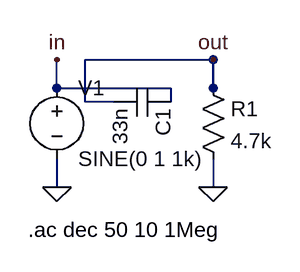
[diagram p0: schematic mystery.asc]
mystery.asc, the LTspice schematic file:
Version 4
SHEET 1 880 680
WIRE 128 80 256 80
WIRE 256 80 256 96
WIRE 192 96 160 96
WIRE 160 96 160 48
WIRE 160 48 304 48
WIRE 304 48 304 80
WIRE 128 80 128 48
WIRE 304 80 304 48
WIRE 128 160 128 192
WIRE 304 160 304 192
FLAG 128 48 in
FLAG 304 48 out
FLAG 128 192 0
FLAG 304 192 0
SYMBOL voltage 128 64 R0
SYMATTR InstName V1
SYMATTR Value SINE(0 1 1k)
SYMATTR Value2 AC 1
SYMBOL cap 256 80 R90
SYMATTR InstName C1
SYMATTR Value 33n
SYMBOL res 288 64 R0
SYMATTR InstName R1
SYMATTR Value 4.7k
TEXT 96 240 Left 2 !.ac dec 50 10 1Meg

The netlist it stands for:
* mystery.asc
V1 in 0 SINE(0 1 1k) AC 1
C1 in out 33n
R1 out 0 4.7k
.ac dec 50 10 1Meg
.backanno
.end